# EAGLE design components (EAGLE 8.0.1)
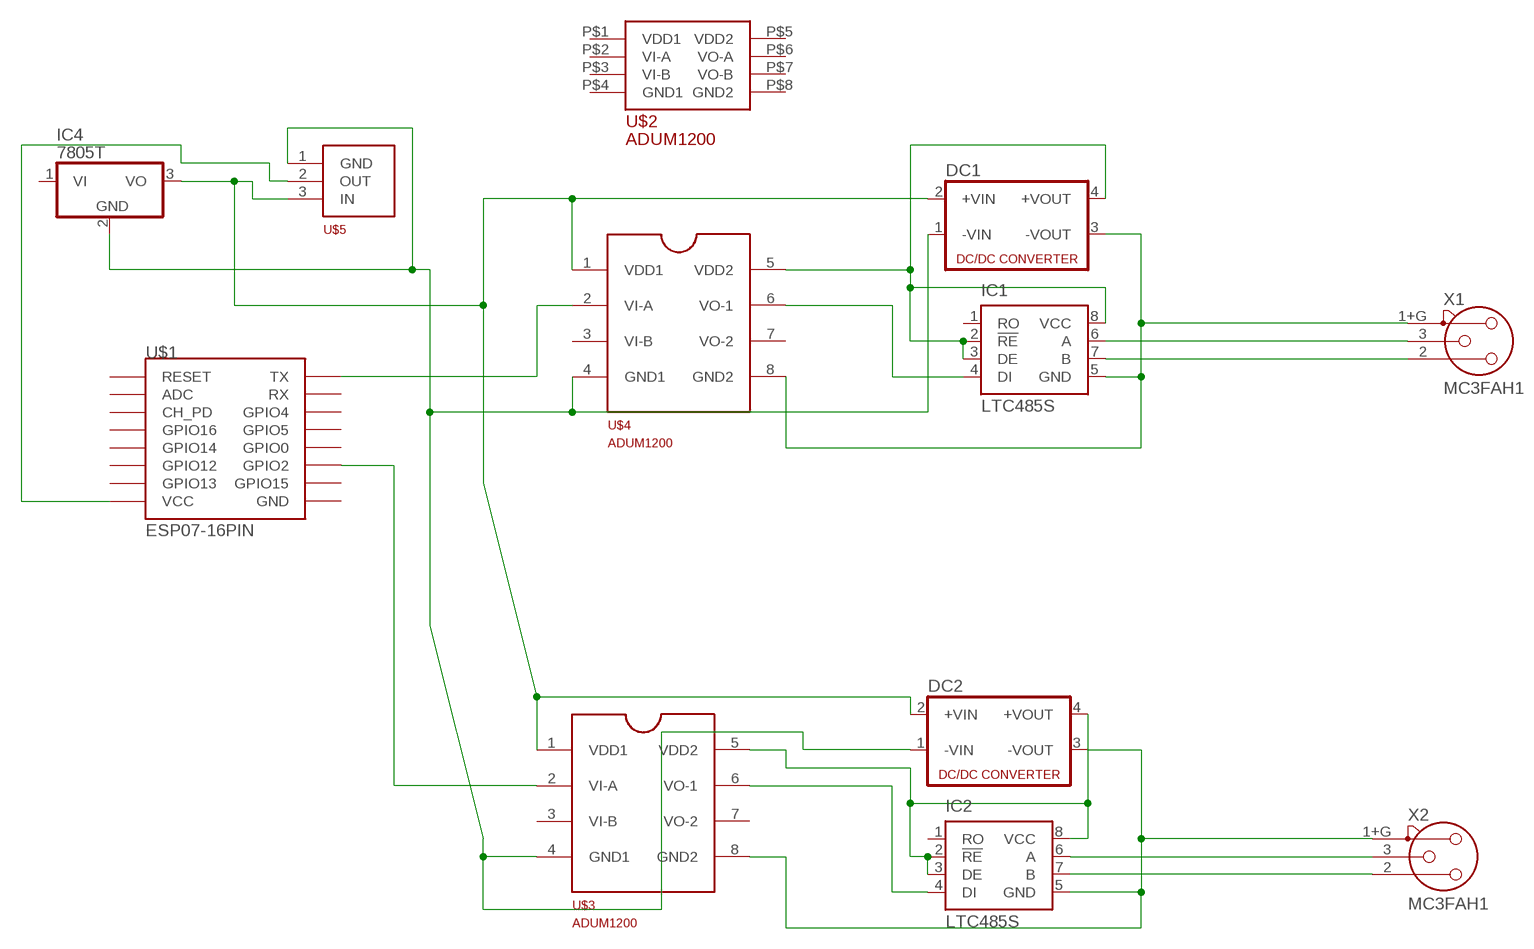
[diagram p0: schematic, sheet 1]

## Parts
DC1  NME  [NME]
DC2  NME  [NME]
IC1  LTC485S  [SOIC8]
IC2  LTC485S  [SOIC8]
IC4  7805T  [TO220H]
U$1  ESP07-16PIN  [ESP07-16PIN]
U$2  ADUM1200SO8  [SO8]
U$3  ADUM1200  [SO8]
U$4  ADUM1200  [SO8]
U$5  AMS1117  [SOT223]
X1  MC3FAH1  [NC3FAH1]
X2  MC3FAH1  [NC3FAH1]

## Nets
N$1: DC2.3(-VOUT) IC2.5(GND) U$3.8(GND2) X2.1+G
N$2: DC1.3(-VOUT) IC1.5(GND) U$4.8(GND2) X1.1+G
N$3: IC2.7(B) X2.2
N$4: IC2.6(A) X2.3
N$5: DC2.4(+VOUT) IC2.2(!RE) IC2.3(DE) IC2.8(VCC) U$3.5(VDD2)
N$6: DC1.4(+VOUT) IC1.2(!RE) IC1.3(DE) IC1.8(VCC) U$4.5(VDD2)
N$7: IC2.4(DI) U$3.6(VO-1)
N$11: DC1.2(+VIN) DC2.2(+VIN) IC4.3(VO) U$3.1(VDD1) U$4.1(VDD1) U$5.3(IN)
N$12: DC1.1(-VIN) DC2.1(-VIN) IC4.2(GND) U$3.4(GND1) U$4.4(GND1) U$5.1(GND)
N$13: U$1.VCC U$5.2(OUT)
N$14: U$1.GPIO2 U$3.2(VI-A)
N$15: U$1.TX U$4.2(VI-A)
N$19: IC1.4(DI) U$4.6(VO-1)
N$21: IC1.7(B) X1.2
N$22: IC1.6(A) X1.3
Unconnected: IC1.1(RO) IC2.1(RO) IC4.1(VI) U$1.ADC U$1.CH_PD U$1.GND U$1.GPIO0 U$1.GPIO4 U$1.GPIO5 U$1.GPIO12 U$1.GPIO13 U$1.GPIO14 U$1.GPIO15 U$1.GPIO16 U$1.REST(RESET) U$1.RX U$2.P$1(VDD1) U$2.P$2(VI-A) U$2.P$3(VI-B) U$2.P$4(GND1) U$2.P$5(VDD2) U$2.P$6(VO-A) U$2.P$7(VO-B) U$2.P$8(GND2) U$3.3(VI-B) U$3.7(VO-2) U$4.3(VI-B) U$4.7(VO-2)

## Library data of the parts
DC1 DC2 = dc-dc-converter:NME: DC-DC CONVERTER; MF: C & D TECHNOLOGIES, INC; MPN: NME1205D; OC_FARNELL: 1021466; OC_NEWARK: 98B8198
IC1 IC2 = linear-technology:LTC485: Low Power RS485 Interface Transceiver Source: http://www.linear.com/pc/downloadDocument.do?navId=H0,C1,C1007,C1017,P2064,D1718; OC_FARNELL: unknown; OC_NEWARK: unknown
IC4 = linear:78*: Positive VOLTAGE REGULATOR Source: http://cache.national.com/ds/LM/LM78L05.pdf http://www.fairchildsemi.com/ds/LM/LM7805.pdf
U$1 = esp8266modules:ESP07-16PIN: ESP8266 Wifi module 07 - 16 pins; DIMENSIONS: 22.0 x 16.0 mm; PINS: 16; PITCH: 0.078" / 2 mm
U$2 = GenericRobQueTools:ADUM1200
U$3 U$4 = ref-packages-que:ADUM1200: Dual-Channel Digital Isolator
U$5 = ref-packages-que:AMS1117: 1A LOW DROPOUT VOLTAGE REGULATOR
X1 X2 = con-neutrik_ag:MC3?: Neutrik Audio Connector XLR SERIES Stereo 1/4" jack Source: www.neutrik.com/; OC_FARNELL: unknown; OC_NEWARK: unknown

## Board
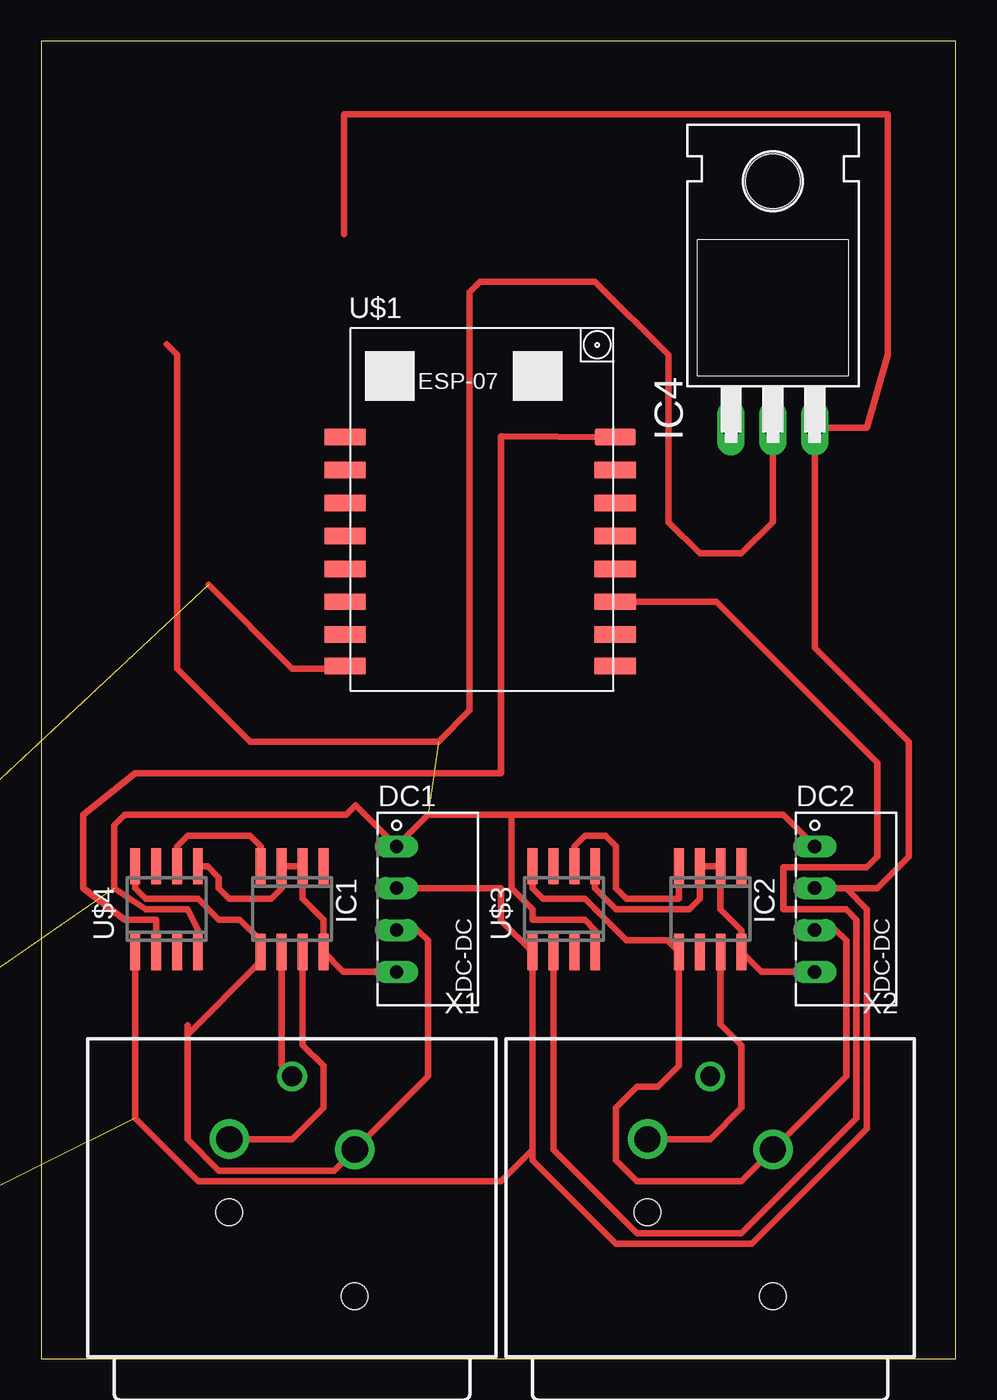
[diagram p1: board, top side]
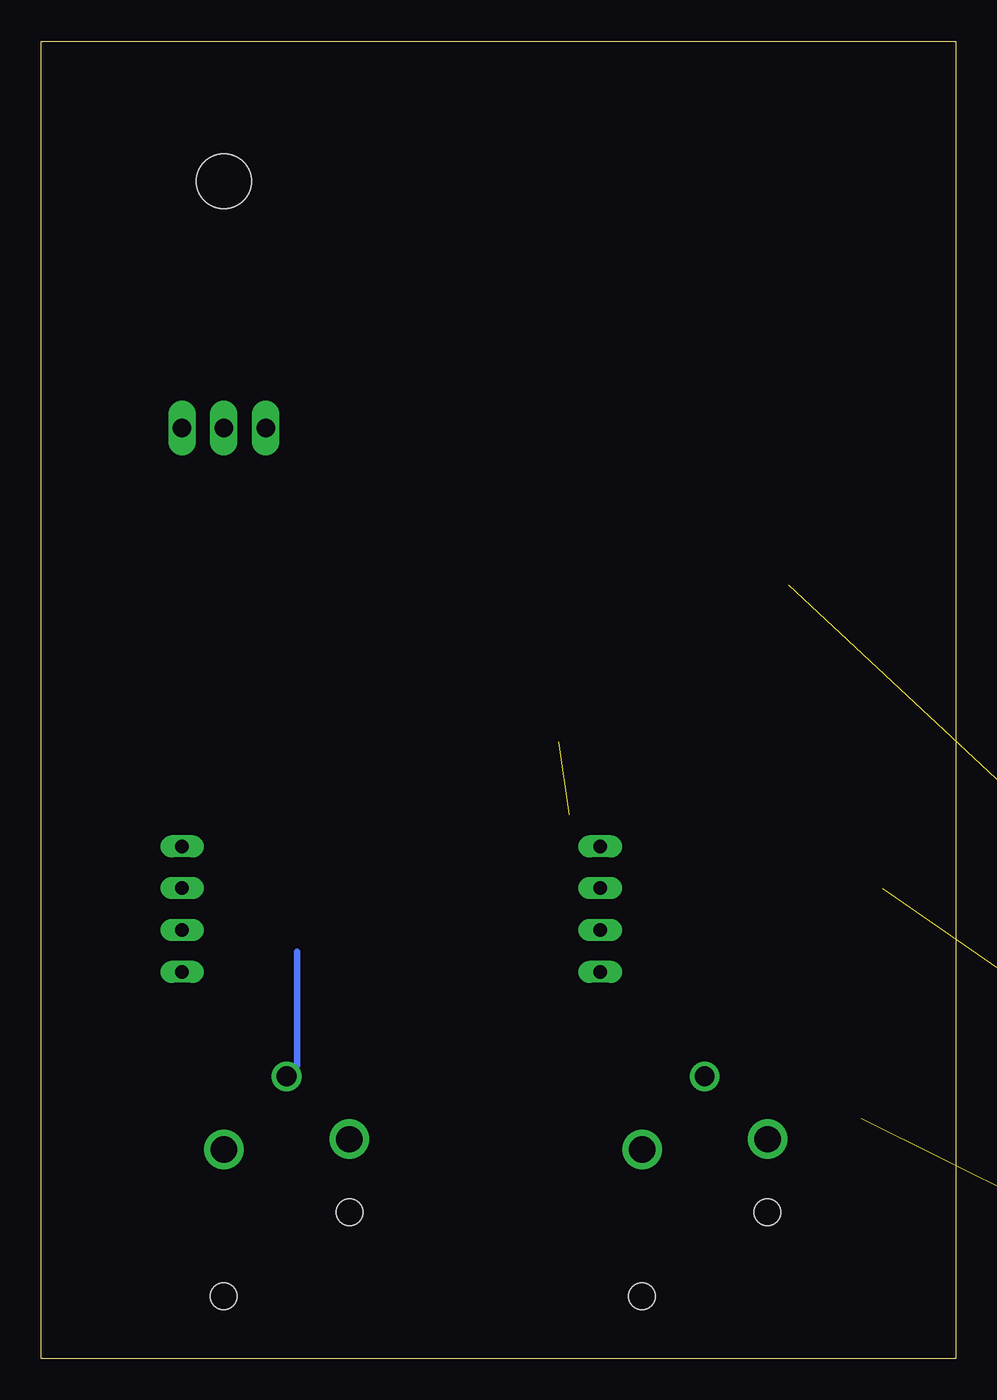
[diagram p2: board, bottom side, seen from below]

Size 55.55 x 80 mm. Coordinates in mm from the lower left corner, seen from the top.
Outline: 0,0 55.55,0 55.55,80 0,80 0,0
Copper layers (1*16): Top 0.035mm / dielectric 1.5mm / Bottom 0.035mm
Design rules "default": minimum track width 10mil, minimum drill 24mil, track to track 8mil, track to pad 8mil, pad to pad 8mil, via to via 8mil, smd to smd 8mil, copper to edge 40mil, drill to drill 8mil, minimum pad ring 10mil, minimum via ring 8mil, stop-mask expansion 4mil, vias tented up to drill 0mil, thermal gap 10mil

### Footprints (pad centres in the part's own frame; a part is rotated, then mirrored left to right if it is on the bottom)
NME = drill 0.813 long: 1 0,3.81; 2 0,1.27; 3 0,-1.27; 4 0,-3.81
SOIC8 = smd 0.6 x 2.2: 1 -1.905,-2.6; 2 -0.635,-2.6; 3 0.635,-2.6; 4 1.905,-2.6; 5 1.905,2.6; 6 0.635,2.6; 7 -0.635,2.6; 8 -1.905,2.6
TO220H = drill 1.118 long: 1 -2.54,-10.16; 2 0,-10.16; 3 2.54,-10.16 | hole 3.302: 0,4.826
ESP07-16PIN = smd 2.5 x 1: ADC -8.2,3.8; CH_PD -8.2,1.8; GND 8.2,-8.105; GPIO0 8.2,-2.2; GPIO2 8.2,-4.2; GPIO4 8.2,1.8; GPIO5 8.2,-0.2; GPIO12 -8.2,-4.2; GPIO13 -8.2,-6.2; GPIO14 -8.2,-2.2; GPIO15 8.2,-6.2; GPIO16 -8.2,-0.2; REST -8.2,5.8; RX 8.2,3.8; TX 8.2,5.8; VCC -8.2,-8.105
SO8 = smd 1.27 x 0.66: P$1 -2.54,1.27; P$2 -2.54,0; P$3 -2.54,-1.27; P$4 -2.54,-2.54; P$5 2.54,1.27; P$6 2.54,0; P$7 2.54,-1.27; P$8 2.54,-2.54
SO8' = smd 0.6 x 2.2: 1 -1.905,-2.6; 2 -0.635,-2.6; 3 0.635,-2.6; 4 1.905,-2.6; 5 1.905,2.6; 6 0.635,2.6; 7 -0.635,2.6; 8 -1.905,2.6
SOT223 = smd 1.219 x 2.235: 1 -2.311,-3.099; 2 0,-3.099; 3 2.311,-3.099 | smd 3.6 x 2.2: 4 0,3.099
NC3FAH1 = drill 1.6: 1+G -3.81,0.635; 2 3.81,0 | drill 1.2: 3 0,-3.815 | hole 1.6: -3.81,9.525; 3.81,4.445

### Placement (x,y rotation side)
DC1  21.59,27.3 0 top
DC2  46.99,27.3 0 top
IC1  15.24,27.3 180 top
IC2  40.64,27.3 180 top
IC4  44.45,66.67 0 top
U$1  26.67,50.16 0 top
U$2  -58.42,62.23 0 top  (outside the outline)
U$3  ADUM1200  [SO8']  31.75,27.3 0 top
U$4  ADUM1200  [SO8']  7.62,27.3 0 top
U$5  -56.52,-12.06 0 top  (outside the outline)
X1  15.24,13.34 180 top
X2  40.64,13.34 180 top

### Tracks (layer width: path | path; a pad name or v marks a point on that pad's centre or on a via)
N$1
  Top 0.406: DC2.3 48.26,26.04 48.9,25.4 48.9,17.14 X2.1+G 42.55,10.79 36.2,10.79 34.92,12.06 34.92,15.24 36.2,16.51 37.47,16.51 38.73,17.78 IC2.5 38.04,25.4 35.56,25.4 33.02,27.94 30.48,27.94 29.84,28.57 U$3.8
N$2
  Top 0.406: DC1.3 22.86,26.04 23.5,25.4 23.5,17.14 X1.1+G 17.78,11.43 10.79,11.43 8.89,13.34 8.89,19.68 | 8.89,19.68 8.89,20.26 | 8.89,19.68 13.34,24.13 IC1.5 13.34,25.4 12.06,26.67 10.79,26.67 9.53,27.94 6.35,27.94 5.71,28.57 U$4.8
N$3
  Top 0.406: IC2.7 41.27,20.32 42.55,19.05 42.55,15.24 40.64,13.34 X2.2
N$4  (1 unrouted)
  Bottom 0.406: X2.3 40.01,17.79 IC2.6
N$5
  Top 0.406: DC2.4 43.76,23.5 IC2.8 42.55,26.04 41.27,27.3 IC2.2 IC2.3 40.01,27.94 39.37,27.3 34.92,27.3 33.66,28.57 U$3.5
N$6
  Top 0.406: DC1.4 18.36,23.5 IC1.8 17.14,26.67 15.88,27.94 IC1.2 IC1.3 14.61,28.57 13.97,27.94 11.43,27.94 10.79,28.57 10.79,29.21 10.1,29.91 U$4.5
N$7
  Top 0.406: IC2.4 38.73,27.94 35.56,27.94 34.92,28.57 34.92,31.11 34.29,31.75 33.02,31.75 32.38,31.11 U$3.6
N$11  (1 unrouted)
  Top 0.406: DC1.2 27.94,28.57 27.94,26.61 U$3.1 29.84,12.7 | 18.41,68.26 18.41,75.56 51.44,75.56 51.44,60.96 50.16,56.52 IC4.3 46.99,43.18 52.7,37.47 52.7,30.48 50.8,28.57 DC2.2 48.9,28.57 50.16,27.3 50.16,13.97 43.18,6.99 34.92,6.99 29.84,12.06 29.84,12.7 | U$4.1 5.71,14.61 9.53,10.79 27.94,10.79 29.84,12.7
N$12  (2 unrouted)
  Top 0.406: DC2.1 45.09,33.02 28.57,33.02 | 28.57,33.02 23.5,33.02 DC1.1 19.11,33.59 18.54,33.02 5.08,33.02 4.45,32.38 4.45,28.57 6.35,27.3 8.89,27.3 9.53,26.04 U$4.4 | U$3.4 33.66,26.04 33.02,26.67 29.84,26.67 29.84,27.3 28.57,28.57 28.57,33.02 | IC4.2 44.45,50.8 42.55,48.9 40.01,48.9 38.1,50.8 38.1,60.96 33.66,65.41 26.67,65.41 26.04,64.77 26.04,39.37 24.13,37.47 12.7,37.47 8.26,41.91 8.26,60.96 7.62,61.59
N$13  (1 unrouted)
  Top 0.406: 10.16,46.99 15.24,41.91 18.32,41.91 U$1.VCC
N$14
  Top 0.406: U$1.GPIO2 41.03,45.97 50.8,36.2 50.8,30.48 50.16,29.84 45.09,29.84 45.09,27.3 48.9,27.3 49.53,26.67 49.53,14.61 42.55,7.62 36.2,7.62 31.11,12.7 U$3.2
N$15
  Top 0.406: U$1.TX 27.94,56.02 27.94,35.56 5.71,35.56 2.54,33.02 2.54,28.57 5.08,26.67 6.99,26.67 U$4.2
N$19
  Top 0.406: IC1.4 13.34,31.11 12.7,31.75 8.89,31.75 8.26,31.11 U$4.6
N$21
  Top 0.406: IC1.7 15.88,19.05 17.14,17.78 17.14,15.24 15.24,13.34 X1.2
N$22
  Top 0.406: X1.3 14.61,17.79 IC1.6